# Altium schematic sheet P12_CAN FD1~4.SchDoc
size 420 x 297 mm
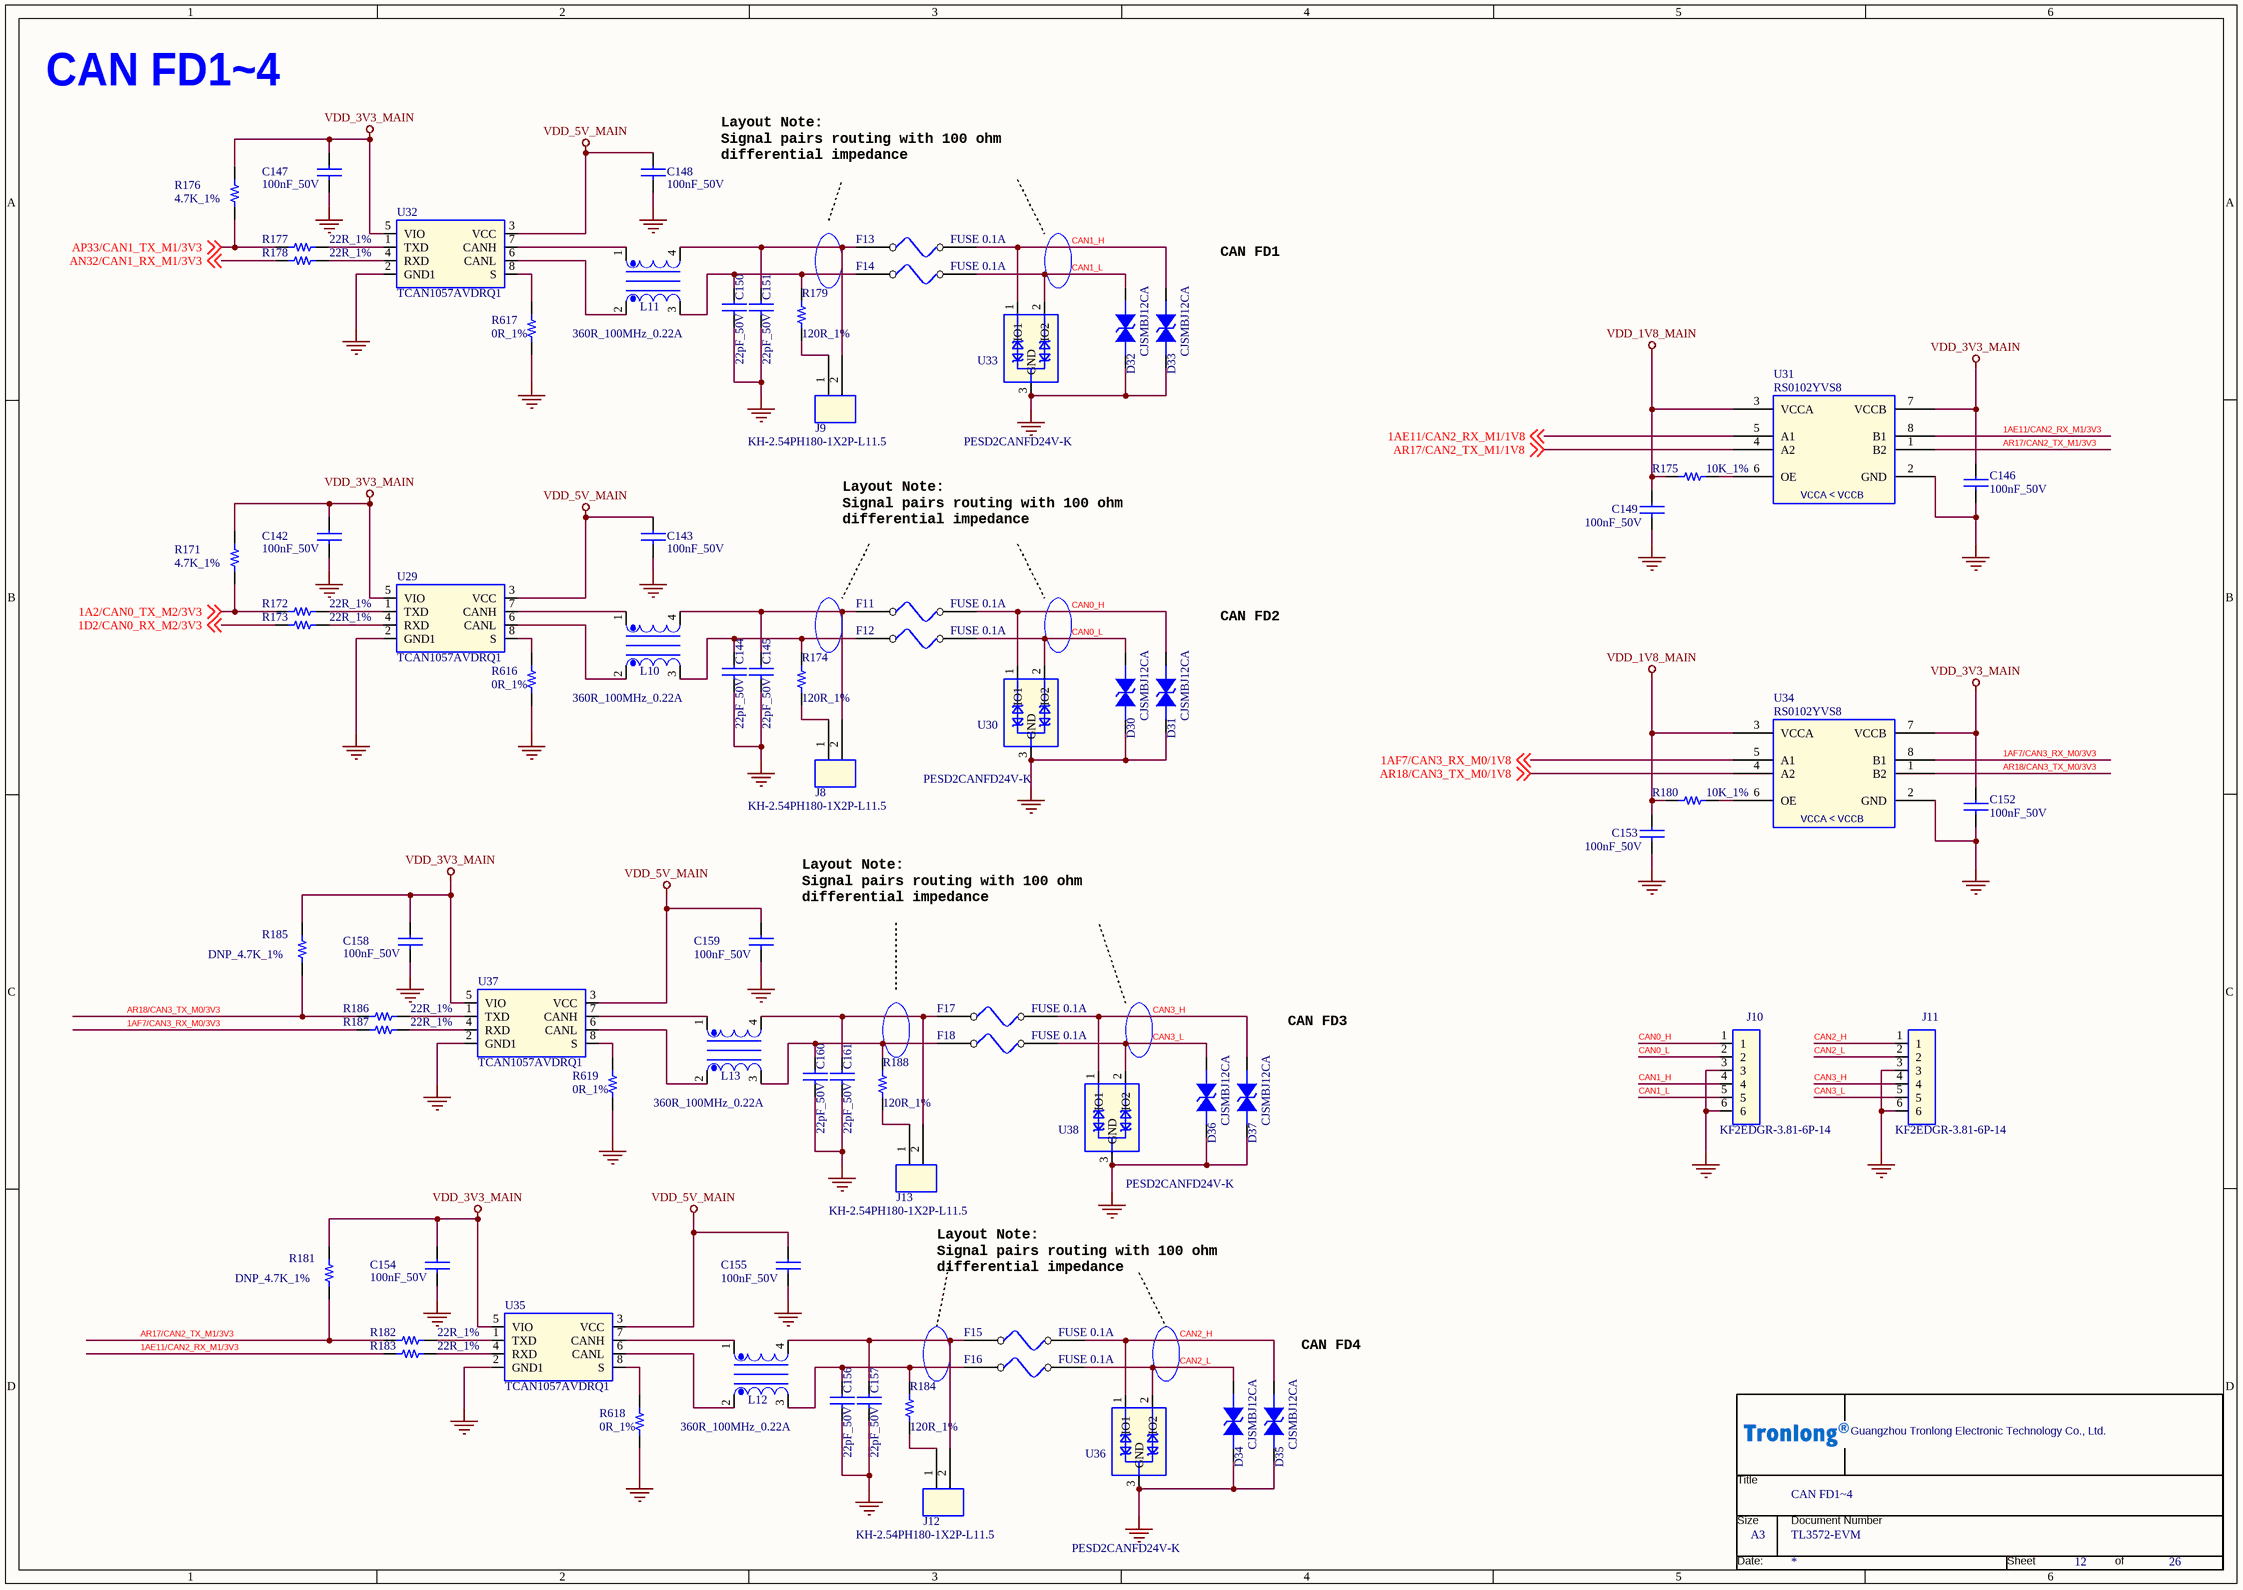
[diagram p0: P12_CAN FD1~4.SchDoc]

## Parts
*  Doc: TL3572-EVM  Title: CAN FD1~4  OrgName: Guangzhou Tronlong Electronic Technology Co., Ltd.  Page Size: A3  Page Number: 12  Page Count: 26  (hidden comment: Tronlong_TITTLE_20211115)  (graphical)
C142  100nF_50V  [C0402]
C143  100nF_50V  [C0402]
C144  22pF_50V  [C0603]
C145  22pF_50V  [C0603]
C146  100nF_50V  [C0402]
C147  100nF_50V  [C0402]
C148  100nF_50V  [C0402]
C149  100nF_50V  [C0402]
C150  22pF_50V  [C0603]
C151  22pF_50V  [C0603]
C152  100nF_50V  [C0402]
C153  100nF_50V  [C0402]
C154  100nF_50V  [C0402]
C155  100nF_50V  [C0402]
C156  22pF_50V  [C0603]
C157  22pF_50V  [C0603]
C158  100nF_50V  [C0402]
C159  100nF_50V  [C0402]
C160  22pF_50V  [C0603]
C161  22pF_50V  [C0603]
D30  CJSMBJ12CA  [SMB]
D31  CJSMBJ12CA  [SMB]
D32  CJSMBJ12CA  [SMB]
D33  CJSMBJ12CA  [SMB]
D34  CJSMBJ12CA  [SMB]
D35  CJSMBJ12CA  [SMB]
D36  CJSMBJ12CA  [SMB]
D37  CJSMBJ12CA  [SMB]
F11  FUSE 0.1A  [F0805]
F12  FUSE 0.1A  [F0805]
F13  FUSE 0.1A  [F0805]
F14  FUSE 0.1A  [F0805]
F15  FUSE 0.1A  [F0805]
F16  FUSE 0.1A  [F0805]
F17  FUSE 0.1A  [F0805]
F18  FUSE 0.1A  [F0805]
J8  KH-2.54PH180-1X2P-L11.5  [header_1x2p_2d54_male]
J9  KH-2.54PH180-1X2P-L11.5  [header_1x2p_2d54_male]
J10  KF2EDGR-3.81-6P-14  [kf2eg_3_81-6p]
J11  KF2EDGR-3.81-6P-14  [kf2eg_3_81-6p]
J12  KH-2.54PH180-1X2P-L11.5  [header_1x2p_2d54_male]
J13  KH-2.54PH180-1X2P-L11.5  [header_1x2p_2d54_male]
L10  360R_100MHz_0.22A  [SMD-L2012M-4P]
L11  360R_100MHz_0.22A  [SMD-L2012M-4P]
L12  360R_100MHz_0.22A  [SMD-L2012M-4P]
L13  360R_100MHz_0.22A  [SMD-L2012M-4P]
R171  4.7K_1%  [R0402]
R172  22R_1%  [R0402]
R173  22R_1%  [R0402]
R174  120R_1%  [R0805]
R175  10K_1%  [R0402]
R176  4.7K_1%  [R0402]
R177  22R_1%  [R0402]
R178  22R_1%  [R0402]
R179  120R_1%  [R0805]
R180  10K_1%  [R0402]
R181  DNP_4.7K_1%  [R0402]
R182  22R_1%  [R0402]
R183  22R_1%  [R0402]
R184  120R_1%  [R0805]
R185  DNP_4.7K_1%  [R0402]
R186  22R_1%  [R0402]
R187  22R_1%  [R0402]
R188  120R_1%  [R0805]
R616  0R_1%  [R0402]
R617  0R_1%  [R0402]
R618  0R_1%  [R0402]
R619  0R_1%  [R0402]
U29  TCAN1057AVDRQ1  [soic8_d8]
U30  PESD2CANFD24V-K  [SOT23-3]
U31  RS0102YVS8  [SOP8-20-91]
U32  TCAN1057AVDRQ1  [soic8_d8]
U33  PESD2CANFD24V-K  [SOT23-3]
U34  RS0102YVS8  [SOP8-20-91]
U35  TCAN1057AVDRQ1  [soic8_d8]
U36  PESD2CANFD24V-K  [SOT23-3]
U37  TCAN1057AVDRQ1  [soic8_d8]
U38  PESD2CANFD24V-K  [SOT23-3]

## Nets
GND: C142.2 C143.2 C144.2 C145.2 C146.2 C147.2 C148.2 C149.2 C150.2 C151.2 C152.2 C153.2 C154.2 C155.2 C156.2 C157.2 C158.2 C159.2 C160.2 C161.2 D30.1 D31.1 D32.1 D33.1 D34.1 D35.1 D36.1 D37.1 J10.3 J10.6 J11.3 J11.6 R616.2 R617.2 R618.2 R619.2 U29.2(GND1) U30.3(GND) U31.2(GND) U32.2(GND1) U33.3(GND) U34.2(GND) U35.2(GND1) U36.3(GND) U37.2(GND1) U38.3(GND)
VDD_1V8_MAIN: C149.1 C153.1 R175.1 R180.1 U31.3(VCCA) U34.3(VCCA)
VDD_3V3_MAIN: C142.1 C146.1 C147.1 C152.1 C154.1 C158.1 R171.1 R176.1 R181.1 R185.1 U29.5(VIO) U31.7(VCCB) U32.5(VIO) U34.7(VCCB) U35.5(VIO) U37.5(VIO)
VDD_5V_MAIN: C143.1 C148.1 C155.1 C159.1 U29.3(VCC) U32.3(VCC) U35.3(VCC) U37.3(VCC)
1A2/CAN0_TX_M2/3V3: R171.2 R172.1 ; off-sheet 1A2/CAN0_TX_M2/3V3
1AE11/CAN2_RX_M1/1V8: U31.5(A1) ; off-sheet 1AE11/CAN2_RX_M1/1V8
1AE11/CAN2_RX_M1/3V3: R183.1 U31.8(B1)
1AF7/CAN3_RX_M0/1V8: U34.5(A1) ; off-sheet 1AF7/CAN3_RX_M0/1V8
1AF7/CAN3_RX_M0/3V3: R187.1 U34.8(B1)
1D2/CAN0_RX_M2/3V3: R173.1 ; off-sheet 1D2/CAN0_RX_M2/3V3
AN32/CAN1_RX_M1/3V3: R178.1 ; off-sheet AN32/CAN1_RX_M1/3V3
AP33/CAN1_TX_M1/3V3: R176.2 R177.1 ; off-sheet AP33/CAN1_TX_M1/3V3
AR17/CAN2_TX_M1/1V8: U31.4(A2) ; off-sheet AR17/CAN2_TX_M1/1V8
AR17/CAN2_TX_M1/3V3: R181.2 R182.1 U31.1(B2)
AR18/CAN3_TX_M0/1V8: U34.4(A2) ; off-sheet AR18/CAN3_TX_M0/1V8
AR18/CAN3_TX_M0/3V3: R185.2 R186.1 U34.1(B2)
CAN0_H: D31.2 F11.2 J10.1 U30.1(IO1)
CAN0_L: D30.2 F12.2 J10.2 U30.2(IO2)
CAN1_H: D33.2 F13.2 J10.4 U33.1(IO1)
CAN1_L: D32.2 F14.2 J10.5 U33.2(IO2)
CAN2_H: D35.2 F15.2 J11.1 U36.1(IO1)
CAN2_L: D34.2 F16.2 J11.2 U36.2(IO2)
CAN3_H: D37.2 F17.2 J11.4 U38.1(IO1)
CAN3_L: D36.2 F18.2 J11.5 U38.2(IO2)
NetC144_1: C144.1 F12.1 L10.3 R174.2
NetC145_1: C145.1 F11.1 J8.2 L10.4
NetC150_1: C150.1 F14.1 L11.3 R179.2
NetC151_1: C151.1 F13.1 J9.2 L11.4
NetC156_1: C156.1 F16.1 L12.3 R184.2
NetC157_1: C157.1 F15.1 J12.2 L12.4
NetC160_1: C160.1 F18.1 L13.3 R188.2
NetC161_1: C161.1 F17.1 J13.2 L13.4
NetJ8_1: J8.1 R174.1
NetJ9_1: J9.1 R179.1
NetJ12_1: J12.1 R184.1
NetJ13_1: J13.1 R188.1
NetL10_1: L10.1 U29.7(CANH)
NetL10_2: L10.2 U29.6(CANL)
NetL11_1: L11.1 U32.7(CANH)
NetL11_2: L11.2 U32.6(CANL)
NetL12_1: L12.1 U35.7(CANH)
NetL12_2: L12.2 U35.6(CANL)
NetL13_1: L13.1 U37.7(CANH)
NetL13_2: L13.2 U37.6(CANL)
NetR172_2: R172.2 U29.1(TXD)
NetR173_2: R173.2 U29.4(RXD)
NetR175_2: R175.2 U31.6(OE)
NetR177_2: R177.2 U32.1(TXD)
NetR178_2: R178.2 U32.4(RXD)
NetR180_2: R180.2 U34.6(OE)
NetR182_2: R182.2 U35.1(TXD)
NetR183_2: R183.2 U35.4(RXD)
NetR186_2: R186.2 U37.1(TXD)
NetR187_2: R187.2 U37.4(RXD)
NetR616_1: R616.1 U29.8(S)
NetR617_1: R617.1 U32.8(S)
NetR618_1: R618.1 U35.8(S)
NetR619_1: R619.1 U37.8(S)

## Notes on the sheet
- CAN FD1~4
- Layout Note:
  Signal pairs routing with 100 ohm
  differential impedance
- CAN FD1
- CAN FD2
- (near C159) Layout Note:
  Signal pairs routing with 100 ohm
  differential impedance
- CAN FD3
- (near D35) CAN FD4
- (in symbol Tronlong_TITTLE_20211115) Title; Size; Document Number; Date:; Sheet; of
- (in symbol TXS0102DCUR_0) VCCA＜VCCB

## Library data of the parts
* = Tronlong_TITTLE_20211115: RevCode: A?; Page Create Date: March  8, 1995; Page Modify Date: *
C142 C143 = CAP NP_Dup2: 贴片陶瓷电容,100nF,10%,50V,X7R; Manufacturer Character: 中国大陆; Manufacturer: 广东风华高新科技股份有限公司（FH）; Manufacturer PartNumber: 0402B104K500NT; As-Welded: /; Operation Temperature（℃）: -55~+125(Ta); ERP Number: 005.0001.0001.00681; Eco-Label: ROHS; PCB Footprint: C0402; Part Status: 试用; Temperature: -55~125℃
C144 C150 C156 = CAP NP_Dup2: 贴片陶瓷电容,22pF,5%,50V,COG; Manufacturer PartNumber: 0603CG220J500NT; Manufacturer: 广东风华高新科技股份有限公司（FH）; Manufacturer Character: 中国大陆; Eco-Label: EXEMPTION; ERP Number: 005.0001.0001.00542; Operation Temperature（℃）: -55~+125(Ta); As-Welded: /; PCB Footprint: C0603; Temperature: -55~125℃; Part Status: 优选
C145 C157 = CAP NP_Dup2: 贴片陶瓷电容,22pF,5%,50V,COG; Manufacturer Character: 中国大陆; Manufacturer PartNumber: 0603CG220J500NT; Manufacturer: 广东风华高新科技股份有限公司（FH）; Eco-Label: EXEMPTION; ERP Number: 005.0001.0001.00542; Operation Temperature（℃）: -55~+125(Ta); As-Welded: /; PCB Footprint: C0603; Temperature: -55~125℃; Part Status: 优选
C146 C149 C152 C153 = CAP NP_Dup3: 贴片陶瓷电容,100nF,10%,50V,X7R; Manufacturer: 广东风华高新科技股份有限公司（FH）; Manufacturer PartNumber: 0402B104K500NT; Manufacturer Character: 中国大陆; As-Welded: /; Operation Temperature（℃）: -55~+125(Ta); ERP Number: 005.0001.0001.00681; Eco-Label: ROHS; PCB Footprint: C0402; Part Status: 试用
C147 C148 = CAP NP_Dup2: 贴片陶瓷电容,100nF,10%,50V,X7R; Manufacturer PartNumber: 0402B104K500NT; Manufacturer: 广东风华高新科技股份有限公司（FH）; Manufacturer Character: 中国大陆; Eco-Label: ROHS; ERP Number: 005.0001.0001.00681; Operation Temperature（℃）: -55~+125(Ta); As-Welded: /; PCB Footprint: C0402; Part Status: 试用; Temperature: -55~125℃
C151 C161 = CAP NP_Dup2: 贴片陶瓷电容,22pF,5%,50V,COG; Manufacturer: 广东风华高新科技股份有限公司（FH）; Manufacturer PartNumber: 0603CG220J500NT; Manufacturer Character: 中国大陆; As-Welded: /; Operation Temperature（℃）: -55~+125(Ta); ERP Number: 005.0001.0001.00542; Eco-Label: EXEMPTION; PCB Footprint: C0603; Part Status: 优选; Temperature: -55~125℃
C154 C158 = CAP NP_Dup2: 贴片陶瓷电容,100nF,10%,50V,X7R; Manufacturer: 广东风华高新科技股份有限公司（FH）; Manufacturer PartNumber: 0402B104K500NT; Manufacturer Character: 中国大陆; Eco-Label: ROHS; ERP Number: 005.0001.0001.00681; Operation Temperature（℃）: -55~+125(Ta); As-Welded: /; PCB Footprint: C0402; Part Status: 试用; Temperature: -55~125℃
C155 = CAP NP_Dup2: 贴片陶瓷电容,100nF,10%,50V,X7R; Manufacturer: 广东风华高新科技股份有限公司（FH）; Manufacturer PartNumber: 0402B104K500NT; Manufacturer Character: 中国大陆; As-Welded: /; Operation Temperature（℃）: -55~+125(Ta); ERP Number: 005.0001.0001.00681; Eco-Label: ROHS; PCB Footprint: C0402; Temperature: -55~125℃; Part Status: 试用
C159 = CAP NP_Dup2: 贴片陶瓷电容,100nF,10%,50V,X7R; Manufacturer Character: 中国大陆; Manufacturer PartNumber: 0402B104K500NT; Manufacturer: 广东风华高新科技股份有限公司（FH）; Eco-Label: ROHS; ERP Number: 005.0001.0001.00681; Operation Temperature（℃）: -55~+125(Ta); As-Welded: /; PCB Footprint: C0402; Part Status: 试用; Temperature: -55~125℃
C160 = CAP NP_Dup2: 贴片陶瓷电容,22pF,5%,50V,COG; Manufacturer Character: 中国大陆; Manufacturer: 广东风华高新科技股份有限公司（FH）; Manufacturer PartNumber: 0603CG220J500NT; As-Welded: /; Operation Temperature（℃）: -55~+125(Ta); ERP Number: 005.0001.0001.00542; Eco-Label: EXEMPTION; PCB Footprint: C0603; Part Status: 优选; Temperature: -55~125℃
D30 D31 D33-D35 = DIODE-TRIG: TVS二极管,VRWM=12V,VBR=13.35V,一组,双向; Manufacturer: 江苏长晶科技股份有限公司（JSCJ）; Manufacturer Character: 中国大陆; Eco-Label: ROHS; ERP Number: 005.0001.0017.00082; room: DCIN; Operation Temperature（℃）: -55~+150(Tj); As-Welded: /; PCB Footprint: SMB; Manufacturer PartNumber: CJSMBJ12CA; Temperature: -55~150℃; Part Status: 试用
D32 D36 D37 = DIODE-TRIG: TVS二极管,VRWM=12V,VBR=13.35V,一组,双向; Manufacturer Character: 中国大陆; Manufacturer: 江苏长晶科技股份有限公司（JSCJ）; As-Welded: /; Operation Temperature（℃）: -55~+150(Tj); room: DCIN; ERP Number: 005.0001.0017.00082; Eco-Label: ROHS; Temperature: -55~150℃; Manufacturer PartNumber: CJSMBJ12CA; Part Status: 试用; PCB Footprint: SMB
F11 = FUSE: 自恢复保险丝,Vmax=24V,Imax=100A,Ihold=0.1A; Manufacturer Character: 中国大陆; Manufacturer: 东莞市竞沃电子科技有限公司（TLC）; Manufacturer PartNumber: TLC-PSMD010/24; Eco-Label: ROHS; As-Welded: /; Operation Temperature（℃）: -40~+85(Ta); ERP Number: 005.0001.0011.00038; PCB Footprint: F0805; Temperature: -55~125℃; Part Status: 测评
F12 = FUSE: 自恢复保险丝,Vmax=24V,Imax=100A,Ihold=0.1A; Manufacturer PartNumber: TLC-PSMD010/24; Manufacturer: 东莞市竞沃电子科技有限公司（TLC）; Manufacturer Character: 中国大陆; Eco-Label: ROHS; ERP Number: 005.0001.0011.00038; Operation Temperature（℃）: -40~+85(Ta); As-Welded: /; PCB Footprint: F0805; Temperature: -55~125℃; Part Status: 测评
F13 F15 F18 = FUSE: 自恢复保险丝,Vmax=24V,Imax=100A,Ihold=0.1A; Manufacturer Character: 中国大陆; Manufacturer: 东莞市竞沃电子科技有限公司（TLC）; Manufacturer PartNumber: TLC-PSMD010/24; As-Welded: /; Operation Temperature（℃）: -40~+85(Ta); ERP Number: 005.0001.0011.00038; Eco-Label: ROHS; PCB Footprint: F0805; Part Status: 测评; Temperature: -55~125℃
F14 F17 = FUSE: 自恢复保险丝,Vmax=24V,Imax=100A,Ihold=0.1A; Manufacturer PartNumber: TLC-PSMD010/24; Manufacturer: 东莞市竞沃电子科技有限公司（TLC）; Manufacturer Character: 中国大陆; Operation Temperature（℃）: -40~+85(Ta); As-Welded: /; ERP Number: 005.0001.0011.00038; Eco-Label: ROHS; PCB Footprint: F0805; Part Status: 测评; Temperature: -55~125℃
F16 = FUSE: 自恢复保险丝,Vmax=24V,Imax=100A,Ihold=0.1A; Manufacturer PartNumber: TLC-PSMD010/24; Manufacturer: 东莞市竞沃电子科技有限公司（TLC）; Manufacturer Character: 中国大陆; Eco-Label: ROHS; Operation Temperature（℃）: -40~+85(Ta); As-Welded: /; ERP Number: 005.0001.0011.00038; PCB Footprint: F0805; Temperature: -55~125℃; Part Status: 测评
J8 J9 J12 = CON2_0: 插件单排排针,1x2P,2.54mm,180度; Manufacturer: 深圳市金航标电子有限公司(kinghelm); Manufacturer Character: 中国大陆; As-Welded: /; Operation Temperature（℃）: -40~+105(Ta); ERP Number: 005.0001.0003.00566; Eco-Label: ROHS; PCB Footprint: header_1x2p_2d54_male; Temperature: -40~105℃; Manufacturer PartNumber: KH-2.54PH180-1X2P-L11.5; Part Status: 优选
J10 J11 = CON6: 插拔式端子座,1x6P,3.81mm,90度; Manufacturer Character: 中国大陆; Manufacturer: 慈溪市科发电子有限公司（KEFA）; Operation Temperature（℃）: -40~+105(Ta); As-Welded: /; ERP Number: 005.0001.0003.00419; Eco-Label: ROHS; PCB Footprint: kf2eg_3_81-6p; Manufacturer PartNumber: KF2EDGR-3.81-6P-14; Part Status: 优选
J13 = CON2_0: 插件单排排针,1x2P,2.54mm,180度; Manufacturer Character: 中国大陆; Manufacturer: 深圳市金航标电子有限公司(kinghelm); Eco-Label: ROHS; ERP Number: 005.0001.0003.00566; Operation Temperature（℃）: -40~+105(Ta); As-Welded: /; PCB Footprint: header_1x2p_2d54_male; Part Status: 优选; Manufacturer PartNumber: KH-2.54PH180-1X2P-L11.5; Temperature: -40~105℃
L10 = TFR_AXA_A_1: 贴片共模电感,500mΩ,0.22A,50V,360Ω@100MHz; Manufacturer PartNumber: ACM2012-361-2P-T001; Manufacturer: TDK(日本东电化); Manufacturer Character: 国外; ERP Number: 005.0001.0006.00103; As-Welded: /; Operation Temperature（℃）: -40~+105(Ta); Eco-Label: ROHS; PCB Footprint: SMD-L2012M-4P; Part Status: 测评
L11 L12 = TFR_AXA_A_1: 贴片共模电感,500mΩ,0.22A,50V,360Ω@100MHz; Manufacturer PartNumber: ACM2012-361-2P-T001; Manufacturer: TDK(日本东电化); Manufacturer Character: 国外; Eco-Label: ROHS; As-Welded: /; Operation Temperature（℃）: -40~+105(Ta); ERP Number: 005.0001.0006.00103; PCB Footprint: SMD-L2012M-4P; Part Status: 测评
L13 = TFR_AXA_A_1: 贴片共模电感,500mΩ,0.22A,50V,360Ω@100MHz; Manufacturer Character: 国外; Manufacturer: TDK(日本东电化); Manufacturer PartNumber: ACM2012-361-2P-T001; ERP Number: 005.0001.0006.00103; Operation Temperature（℃）: -40~+105(Ta); As-Welded: /; Eco-Label: ROHS; PCB Footprint: SMD-L2012M-4P; Part Status: 测评
R171 R176 = Resistor_Dup3: 贴片电阻,4.7K,±1%,1/16W; Manufacturer Character: 中国大陆; Manufacturer: 广东风华高新科技股份有限公司（FH）; Manufacturer PartNumber: RC-02K4701FT; CLASS: DISCRETE; As-Welded: /; Operation Temperature（℃）: -55~+125(Ta); ERP Number: 005.0001.0002.01359; Eco-Label: ROHS; PCB Footprint: R0402; Part Status: 试用
R172 R183 = Resistor_Dup3: 贴片电阻,22R,±1%,1/16W; Manufacturer Character: 中国大陆; Manufacturer: 广东风华高新科技股份有限公司（FH）; Manufacturer PartNumber: RC-02K22R0FT; CLASS: DISCRETE; Eco-Label: ROHS; ERP Number: 005.0001.0002.01316; Operation Temperature（℃）: -55~+125(Ta); As-Welded: /; PCB Footprint: R0402; Part Status: 试用; Temperature: -55~155℃
R173 R182 = Resistor_Dup3: 贴片电阻,22R,±1%,1/16W; Manufacturer Character: 中国大陆; Manufacturer PartNumber: RC-02K22R0FT; Manufacturer: 广东风华高新科技股份有限公司（FH）; CLASS: DISCRETE; Eco-Label: ROHS; ERP Number: 005.0001.0002.01316; Operation Temperature（℃）: -55~+125(Ta); As-Welded: /; PCB Footprint: R0402; Part Status: 试用; Temperature: -55~155℃
R174 R179 R184 = Resistor_Dup3: 贴片电阻,120R,±1%,1/8W; Manufacturer Character: 中国大陆; Manufacturer PartNumber: RS-05K1200FT; Manufacturer: 广东风华高新科技股份有限公司（FH）; CLASS: DISCRETE; Eco-Label: ROHS; ERP Number: 005.0001.0002.01050; Operation Temperature（℃）: -55~+155(Ta); As-Welded: /; PCB Footprint: R0805; Temperature: -55~125℃; Part Status: 优选
R175 R180 = Resistor_Dup4: 贴片电阻,10K,±1%,1/16W; Manufacturer: 广东风华高新科技股份有限公司（FH）; Manufacturer PartNumber: RC-02K1002FT; Manufacturer Character: 中国大陆; CLASS: DISCRETE; Eco-Label: ROHS; ERP Number: 005.0001.0002.01326; As-Welded: /; Operation Temperature（℃）: -55~+125(Ta); PCB Footprint: R0402; Part Status: 优选
R177 R187 = Resistor_Dup3: 贴片电阻,22R,±1%,1/16W; Manufacturer PartNumber: RC-02K22R0FT; Manufacturer: 广东风华高新科技股份有限公司（FH）; Manufacturer Character: 中国大陆; CLASS: DISCRETE; As-Welded: /; Operation Temperature（℃）: -55~+125(Ta); ERP Number: 005.0001.0002.01316; Eco-Label: ROHS; PCB Footprint: R0402; Part Status: 试用; Temperature: -55~155℃
R178 R186 = Resistor_Dup3: 贴片电阻,22R,±1%,1/16W; Manufacturer: 广东风华高新科技股份有限公司（FH）; Manufacturer PartNumber: RC-02K22R0FT; Manufacturer Character: 中国大陆; CLASS: DISCRETE; As-Welded: /; Operation Temperature（℃）: -55~+125(Ta); ERP Number: 005.0001.0002.01316; Eco-Label: ROHS; PCB Footprint: R0402; Part Status: 试用; Temperature: -55~155℃
R181 R185 = Resistor_Dup3: RC0402FR-074K7L,0402WGF4701TCE; Manufacturer PartNumber: 4.7K,±1%,R0402,≥1/16W; Manufacturer: 广州创龙; CLASS: DISCRETE; Operation Temperature（℃）: -40~+85(Ta); As-Welded: DNP; ERP Number: 005.0001.0023.00160; Eco-Label: ROHS; PCB Footprint: R0402; Part Status: -; Manufacturer Character: -
R188 = Resistor_Dup3: 贴片电阻,120R,±1%,1/8W; Manufacturer: 广东风华高新科技股份有限公司（FH）; Manufacturer PartNumber: RS-05K1200FT; Manufacturer Character: 中国大陆; CLASS: DISCRETE; As-Welded: /; Operation Temperature（℃）: -55~+155(Ta); ERP Number: 005.0001.0002.01050; Eco-Label: ROHS; PCB Footprint: R0805; Part Status: 优选; Temperature: -55~125℃
R616-R619 = Resistor_Dup3: 贴片电阻,0R,±1%,1/16W; Manufacturer: 广东风华高新科技股份有限公司（FH）; Manufacturer PartNumber: RC-02000FT; Manufacturer Character: 中国大陆; CLASS: DISCRETE; Eco-Label: ROHS; As-Welded: /; Operation Temperature（℃）: -55~+155(Ta); ERP Number: 005.0001.0002.00938; PCB Footprint: R0402; Part Status: 优选
U29 U32 U37 = ISO1042_3: CAN收发器,非隔离,8Mbps; Manufacturer Character: 中国大陆; Manufacturer: Texas Instruments(美国德州仪器); Eco-Label: ROHS; ERP Number: 005.0001.0004.01352; As-Welded: /; Operation Temperature（℃）: -40~+150(Tj); PCB Footprint: soic8_d8; Part Status: 测评; Manufacturer PartNumber: TCAN1057AVDRQ1
U30 U38 = PSM712: TVS二极管,VRWM=24V,VBR=26.7V,两组,双向,30KV,30KV; Manufacturer Character: 中国大陆; Manufacturer: 派克微电子（深圳）有限公司(pakermicro); As-Welded: /; Operation Temperature（℃）: -55~+125(Tj); ERP Number: 005.0001.0017.00074; Eco-Label: ROHS; Manufacturer PartNumber: PESD2CANFD24V-K; Part Status: 试用; PCB Footprint: SOT23-3
U31 U34 = TXS0102DCUR_0: 2位双向电平转换器; Manufacturer Character: 中国大陆; Manufacturer: 江苏润石科技有限公司（RUNIC）; Operation Temperature（℃）: -40~+85(Ta); As-Welded: /; ERP Number: 005.0001.0004.00890; Eco-Label: ROHS; PCB Footprint: SOP8-20-91; Part Status: 试用; Manufacturer PartNumber: RS0102YVS8; Temperature: -40~85℃
U33 U36 = PSM712: TVS二极管,VRWM=24V,VBR=26.7V,两组,双向,30KV,30KV; Manufacturer: 派克微电子（深圳）有限公司(pakermicro); Manufacturer Character: 中国大陆; Eco-Label: ROHS; ERP Number: 005.0001.0017.00074; Operation Temperature（℃）: -55~+125(Tj); As-Welded: /; PCB Footprint: SOT23-3; Part Status: 试用; Manufacturer PartNumber: PESD2CANFD24V-K
U35 = ISO1042_3: CAN收发器,非隔离,8Mbps; Manufacturer: Texas Instruments(美国德州仪器); Manufacturer Character: 中国大陆; Operation Temperature（℃）: -40~+150(Tj); As-Welded: /; ERP Number: 005.0001.0004.01352; Eco-Label: ROHS; PCB Footprint: soic8_d8; Manufacturer PartNumber: TCAN1057AVDRQ1; Part Status: 测评